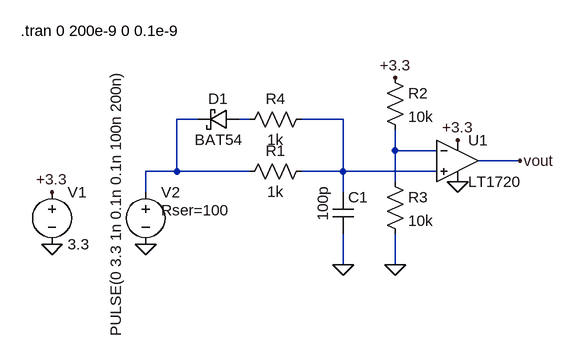
[diagram p0: schematic turn_on_delay.asc]
turn_on_delay.asc, the LTspice schematic file:
Version 4
SHEET 1 880 680
WIRE -304 48 -336 48
WIRE -224 48 -240 48
WIRE -80 48 -144 48
WIRE 0 96 0 64
WIRE 64 96 0 96
WIRE 192 112 128 112
WIRE -336 128 -336 48
WIRE -336 128 -384 128
WIRE -224 128 -336 128
WIRE -80 128 -80 48
WIRE -80 128 -144 128
WIRE 64 128 -80 128
WIRE 0 144 0 96
WIRE -384 160 -384 128
WIRE -80 160 -80 128
WIRE -80 272 -80 224
WIRE 0 272 0 224
FLAG -384 240 0
FLAG -80 272 0
FLAG 0 272 0
FLAG -528 240 0
FLAG -528 160 +3.3
FLAG 0 -16 +3.3
FLAG 96 80 +3.3
FLAG 96 144 0
FLAG 192 112 vout
SYMBOL Comparators\\LT1720 96 48 R0
SYMATTR InstName U1
SYMBOL res -128 112 R90
WINDOW 0 0 56 VBottom 2
WINDOW 3 32 56 VTop 2
SYMATTR InstName R1
SYMATTR Value 1k
SYMBOL cap -96 160 R0
WINDOW 3 -15 -10 VRight 2
SYMATTR InstName C1
SYMATTR Value 100p
SYMBOL res -16 -32 R0
SYMATTR InstName R2
SYMATTR Value 10k
SYMBOL res -16 128 R0
SYMATTR InstName R3
SYMATTR Value 10k
SYMBOL voltage -528 144 R0
WINDOW 123 0 0 Left 0
WINDOW 39 0 0 Left 0
SYMATTR InstName V1
SYMATTR Value 3.3
SYMBOL voltage -384 144 R0
WINDOW 3 -46 -174 VRight 2
WINDOW 123 0 0 Left 0
WINDOW 39 24 44 Left 2
SYMATTR InstName V2
SYMATTR Value PULSE(0 3.3 1n 0.1n 0.1n 100n 200n)
SYMATTR SpiceLine Rser=100
SYMBOL schottky -240 32 R90
WINDOW 0 0 32 VBottom 2
WINDOW 3 32 32 VTop 2
SYMATTR InstName D1
SYMATTR Value BAT54
SYMATTR Description Diode
SYMATTR Type diode
SYMBOL res -128 32 R90
WINDOW 0 0 56 VBottom 2
WINDOW 3 32 56 VTop 2
SYMATTR InstName R4
SYMATTR Value 1k
TEXT -576 -88 Left 2 !.tran 0 200e-9 0 0.1e-9

The netlist it stands for:
* turn_on_delay.asc
XU1 N003 N004 +3.3 0 vout LT1720  ; pins In+ In- V+ V- OUT
R1 N003 N001 1k
C1 N003 0 100p
R2 +3.3 N004 10k
R3 N004 0 10k
V1 +3.3 0 3.3
V2 N001 0 PULSE(0 3.3 1n 0.1n 0.1n 100n 200n) Rser=100
D1 N002 N001 BAT54
R4 N003 N002 1k
.model D D
.lib standard.dio
.tran 0 200e-9 0 0.1e-9
.lib LT1720.sub
.backanno
.end